# EAGLE design Schematic (EAGLE 6.4)
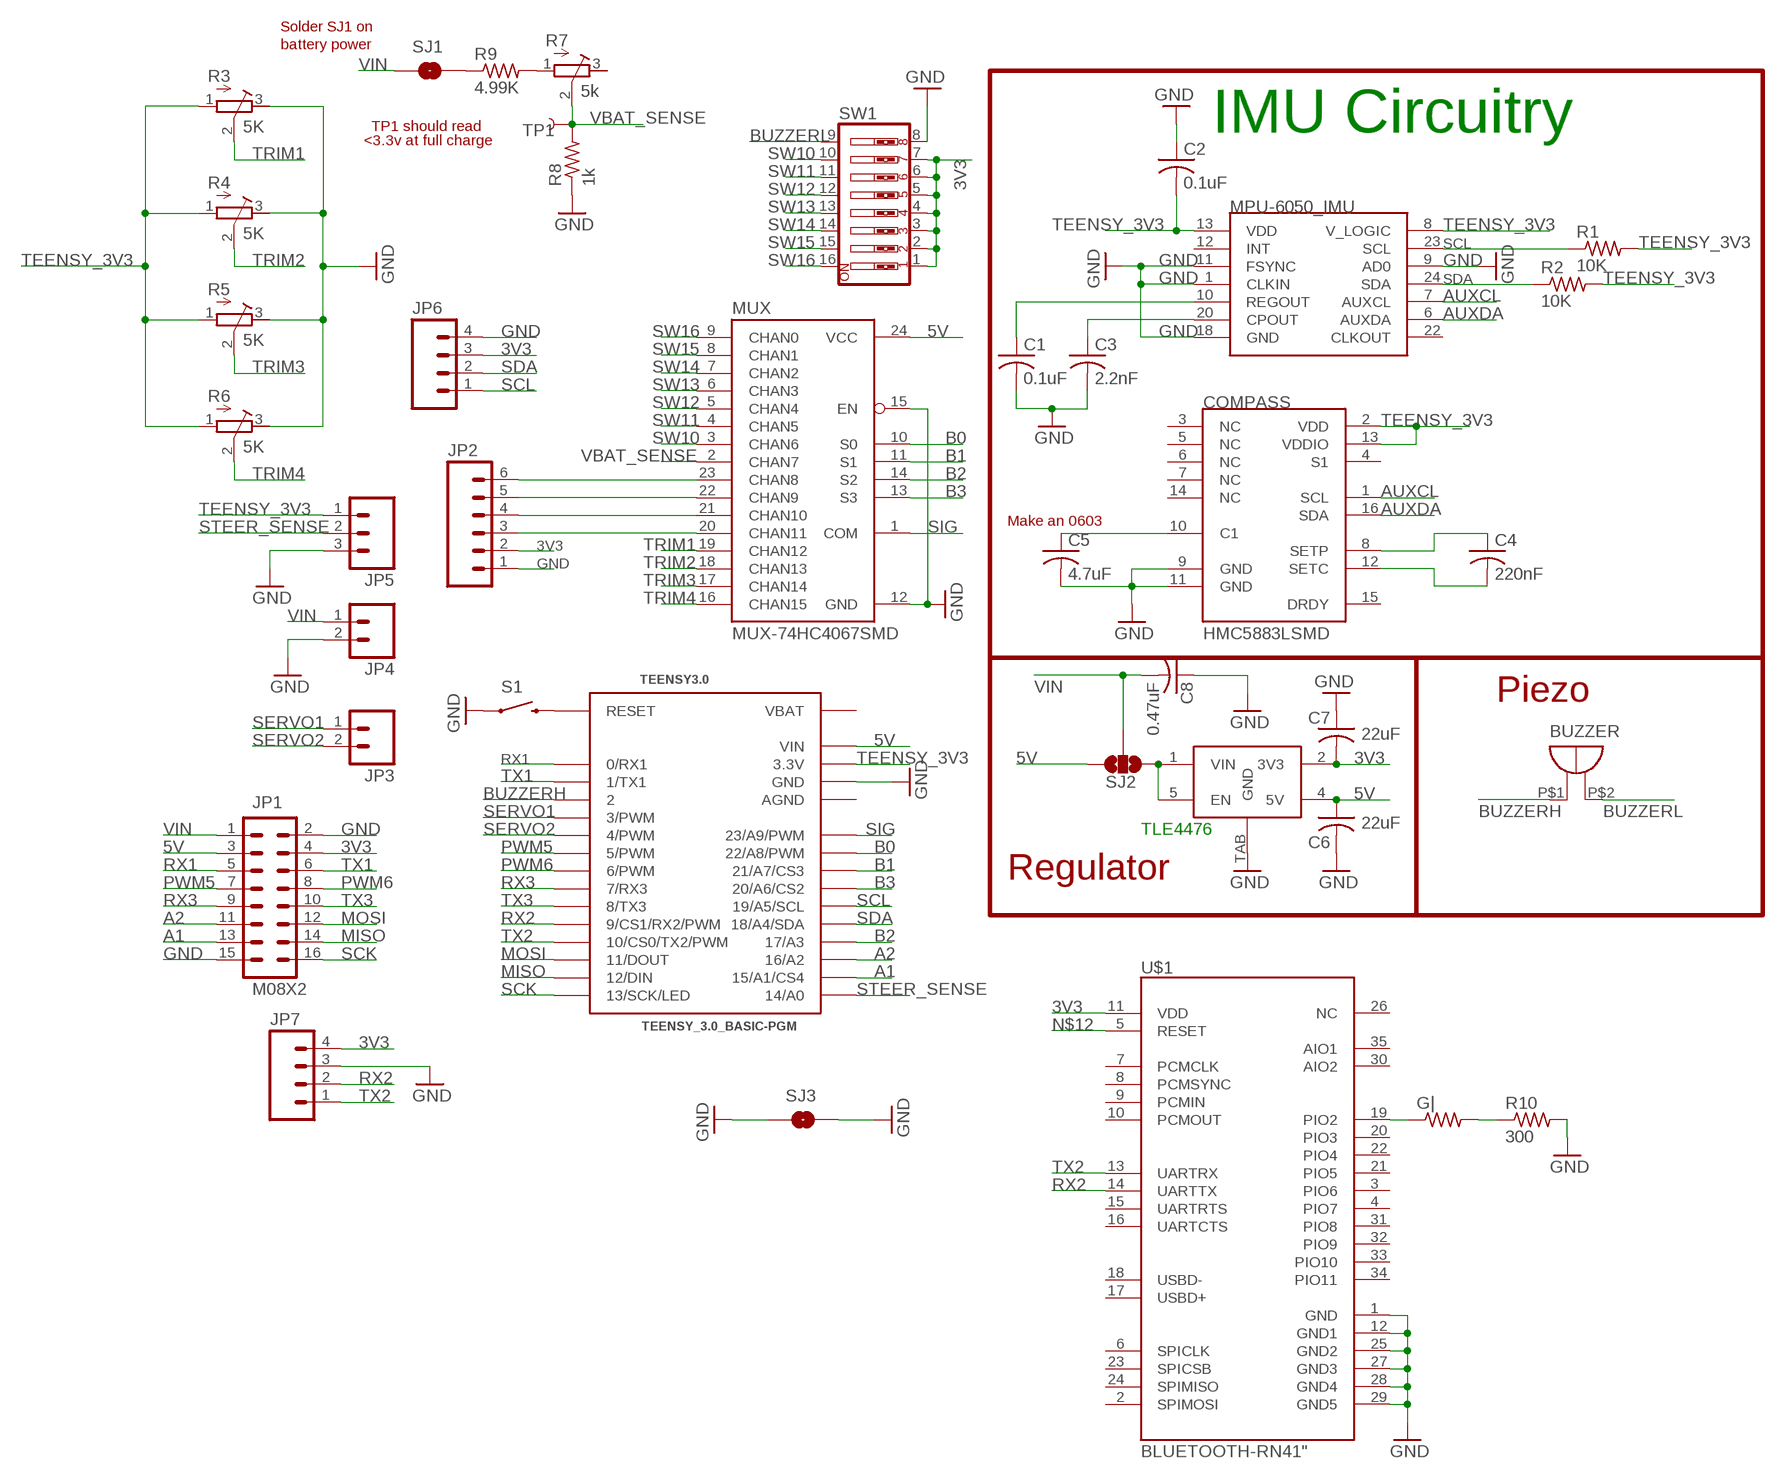
[diagram p0: schematic, sheet 1]

## Parts
BUZZER  PK-12N40PQ  [PK-12N40PQ]
C1  0.1uF  C-USC0603  [C0603]
C2  0.1uF  C-USC0603K  [C0603K]
C3  2.2nF  C-USC0603  [C0603]
C4  220nF  C-USC0402  [C0402]
C5  4.7uF  C-USC0402  [C0402]
C6  22uF  C-USC0805  [C0805]
C7  22uF  C-USC0805  [C0805]
C8  0.47uF  C-USC0805  [C0805]
COMPASS  HMC5883LSMD  [16LPCC]
G|  R-US_R0805  [R0805]
IC1  TLE4467  [TO252-5-11]
JP1  M08X2  [2X8]
JP2  M06SIP  [1X06]
JP3  M023.5MM  [SCREWTERMINAL-3.5MM-2]
JP4  M023.5MM  [SCREWTERMINAL-3.5MM-2]
JP5  M03SCREW  [SCREWTERMINAL-3.5MM-3]
JP6  M04PTH  [1X04]
JP7  M04PTH  [1X04]
MPU-6050_IMU  MPU-6050  [QFN-24]
MUX  MUX-74HC4067SMD  [SSOP24]
R1  10K  R-US_R0603  [R0603]
R2  10K  R-US_R0603  [R0603]
R3  5K  R-TRIMM3304W  [RTRIM3304W]
R4  5K  R-TRIMM3304W  [RTRIM3304W]
R5  5K  R-TRIMM3304W  [RTRIM3304W]
R6  5K  R-TRIMM3304W  [RTRIM3304W]
R7  5k  R-TRIMM3304W  [RTRIM3304W]
R8  1k  R-US_R0603  [R0603]
R9  4.99K  R-US_R0603  [R0603]
R10  300  R-US_R0603  [R0603]
S1  SWITCH-MOMENTARY-2SMD  [TACTILE_SWITCH_SMD]
SJ1  SOLDERJUMPERNO  [SJ_2S-NO]
SJ2  SOLDERJUMPER_2WAYS  [SJ_3]
SJ3  SOLDERJUMPERNO  [SJ_2S-NO]
SW1  SW_DIP-8  [DIPSWITCH-08]
TEENSY3.0  TEENSY_3.0_BASIC-PGM  [TEENSY_3.0_BASIC-PGM]
TP1  TEST-POINT3  [PAD.03X.03]
U$1  BLUETOOTH-RN41"  [RN41]

## Nets
3V3 [3.3V]: C7.2 IC1.2(3V3) JP1.4 JP2.2 JP6.3 JP7.4 SW1.1 SW1.2 SW1.3 SW1.4 SW1.5 SW1.6 SW1.7 U$1.11(VDD)
5V [5V]: C6.1 IC1.4(5V) JP1.3 MUX.24(VCC) SJ2.3 TEENSY3.0.VIN
A1: JP1.13 TEENSY3.0.15/A1(15/A1/CS4)
A2: JP1.11 TEENSY3.0.16/A2
AUXCL [I/O]: COMPASS.1(SCL) MPU-6050_IMU.7(AUXCL)
AUXDA [I/O]: COMPASS.16(SDA) MPU-6050_IMU.6(AUXDA)
B0 [I/O]: MUX.10(S0) TEENSY3.0.22/A8(22/A8/PWM)
B1 [I/O]: MUX.11(S1) TEENSY3.0.21/A7(21/A7/CS3)
B2 [I/O]: MUX.14(S2) TEENSY3.0.17/A3
B3 [I/O]: MUX.13(S3) TEENSY3.0.20/A6(20/A6/CS2)
BUZZERH [I/O]: BUZZER.P$1(+) TEENSY3.0.2
BUZZERL: BUZZER.P$2(-) SW1.9
GND: C1.2 C2.1 C3.2 C5.2 C6.2 C7.1 C8.1 COMPASS.9(GND) COMPASS.11(GND) IC1.TAB(GND) JP1.2 JP1.15 JP2.1 JP4.2 JP5.3 JP6.4 JP7.3 MPU-6050_IMU.1(CLKIN) MPU-6050_IMU.9(AD0) MPU-6050_IMU.11(FSYNC) MPU-6050_IMU.18(GND) MUX.12(GND) MUX.15(EN) R3.3(A) R4.3(A) R5.3(A) R6.3(A) R8.1 R10.2 S1.1 SJ3.1 SJ3.2 SW1.8 TEENSY3.0.GND TEENSY3.0.GND1(GND) U$1.1(GND) U$1.12(GND1) U$1.25(GND2) U$1.27(GND3) U$1.28(GND4) U$1.29(GND5)
MISO: JP1.14 TEENSY3.0.12(12/DIN)
MOSI: JP1.12 TEENSY3.0.11(11/DOUT)
N$1: C1.1 MPU-6050_IMU.10(REGOUT)
N$2: C3.1 MPU-6050_IMU.20(CPOUT)
N$3: R7.1(E) R9.2
N$4: R9.1 SJ1.2
N$5: JP2.6 MUX.23(CHAN8)
N$6: JP2.5 MUX.22(CHAN9)
N$7 [I/O]: C4.1 COMPASS.8(SETP)
N$8 [I/O]: C4.2 COMPASS.12(SETC)
N$9 [I/O]: C5.1 COMPASS.10(C1)
N$10: JP2.4 MUX.21(CHAN10)
N$11: JP2.3 MUX.20(CHAN11)
N$12: S1.3 TEENSY3.0.RESET U$1.5(RESET)
N$13: G|.1 U$1.19(PIO2)
N$14: G|.2 R10.1
PWM5: JP1.7 TEENSY3.0.5(5/PWM)
PWM6: JP1.8 TEENSY3.0.6(6/PWM)
REG_IN [Vss]: IC1.1(VIN) IC1.5(EN) SJ2.1
RX1: JP1.5 TEENSY3.0.0(0/RX1)
RX2: JP7.2 TEENSY3.0.9(9/CS1/RX2/PWM) U$1.14(UARTTX)
RX3: JP1.9 TEENSY3.0.7(7/RX3)
SCK: JP1.16 TEENSY3.0.13(13/SCK/LED)
SCL [I/O]: JP6.1 MPU-6050_IMU.23(SCL) R1.1 TEENSY3.0.19/A5(19/A5/SCL)
SDA [I/O]: JP6.2 MPU-6050_IMU.24(SDA) R2.1 TEENSY3.0.18/A4(18/A4/SDA)
SERVO1 [I/O]: JP3.1 TEENSY3.0.3(3/PWM)
SERVO2 [I/O]: JP3.2 TEENSY3.0.4(4/PWM)
SIG [I/O]: MUX.1(COM) TEENSY3.0.23/A9(23/A9/PWM)
STEER_SENSE: JP5.2 TEENSY3.0.14/A0
SW10: MUX.3(CHAN6) SW1.10
SW11: MUX.4(CHAN5) SW1.11
SW12: MUX.5(CHAN4) SW1.12
SW13: MUX.6(CHAN3) SW1.13
SW14: MUX.7(CHAN2) SW1.14
SW15: MUX.8(CHAN1) SW1.15
SW16: MUX.9(CHAN0) SW1.16
TEENSY_3V3 [3.3V]: C2.2 COMPASS.2(VDD) COMPASS.13(VDDIO) JP5.1 MPU-6050_IMU.8(V_LOGIC) MPU-6050_IMU.13(VDD) R1.2 R2.2 R3.1(E) R4.1(E) R5.1(E) R6.1(E) TEENSY3.0.3.3V TEENSY3.0.3.3V1(3.3V)
TRIM1: MUX.19(CHAN12) R3.2(S)
TRIM2: MUX.18(CHAN13) R4.2(S)
TRIM3: MUX.17(CHAN14) R5.2(S)
TRIM4: MUX.16(CHAN15) R6.2(S)
TX1: JP1.6 TEENSY3.0.1(1/TX1)
TX2: JP7.1 TEENSY3.0.10(10/CS0/TX2/PWM) U$1.13(UARTRX)
TX3: JP1.10 TEENSY3.0.8(8/TX3)
VBAT_SENSE: MUX.2(CHAN7) R7.2(S) R8.2 TP1.P$1
VIN [Vss]: C8.2 JP1.1 JP4.1 SJ1.1 SJ2.2
Unconnected: COMPASS.3(NC) COMPASS.4(S1) COMPASS.5(NC) COMPASS.6(NC) COMPASS.7(NC) COMPASS.14(NC) COMPASS.15(DRDY) MPU-6050_IMU.12(INT) MPU-6050_IMU.22(CLKOUT) R7.3(A) U$1.2(SPIMOSI) U$1.3(PIO6) U$1.4(PIO7) U$1.6(SPICLK) U$1.7(PCMCLK) U$1.8(PCMSYNC) U$1.9(PCMIN) U$1.10(PCMOUT) U$1.15(UARTRTS) U$1.16(UARTCTS) U$1.17(USBD+) U$1.18(USBD-) U$1.20(PIO3) U$1.21(PIO5) U$1.22(PIO4) U$1.23(SPICSB) U$1.24(SPIMISO) U$1.26(NC) U$1.30(AIO2) U$1.31(PIO8) U$1.32(PIO9) U$1.33(PIO10) U$1.34(PIO11) U$1.35(AIO1)

## Notes on the sheet
- Solder SJ1 on
- battery power
- TP1 should read | IMU Circuitry
- <3.3v at full charge
- Make an 0603
- Piezo
- TLE4476
- Regulator

## Power pins joined to a net without a drawn wire
AGND: TEENSY3.0.AGND
VIN: TEENSY3.0.VBAT

## Library data of the parts
BUZZER = buzzer:PK-12N40PQ
C1 = resistor:C-US: CAPACITOR, American symbol; RATED_VOLTAGE: 2
C2 C4-C8 = resistor:C-US: CAPACITOR, American symbol
C3 = resistor:C-US: CAPACITOR, American symbol; RATED_VOLTAGE: 50
COMPASS = SparkFun-Sensors:HMC5883L: 3 Axis Digital Compass IC
G| R1 R2 R8-R10 = resistor:R-US_: RESISTOR, American symbol
IC1 = infineon:TLE4467: Digikey Part number: TLE4476DCT-ND
JP1 = SparkFun-Connectors:M08X2: .1" headers, two rows of 8 each
JP2 = SparkFun-Connectors:M06: Header 6 Standard 6-pin 0.1" header. Use with straight break away headers (SKU : PRT-00116), right angle break away headers (PRT-00553), swiss pins (PRT-00743), machine pins (PRT-00117), and female headers (PRT-00115). Molex polarized connector foot print use with SKU : PRT-08094 with associated crimp pins and housings. NOTES ON THE VARIANTS LOCK and LOCK_LONGPADS... This footprint was designed to help hold the alignment of a through-hole component (i.e. 6-pin header) while soldering it into place. You may notice that each hole has been shifted either up or down by 0.005 of an inch from it's more standard position (which is a perfectly straight line). This slight alteration caused the pins (the squares in the middle) to touch the edges of the holes. Because they are alternating, it causes a "brace" to hold the component in place. 0.005 has proven to be the perfect amount of "off-center" position when using our standard breakaway headers. Although looks a little odd when you look at the bare footprint, once you have a header in there, the alteration is very hard to notice. Also, if you push a header all the way into place, it is covered up entirely on the bottom side. This idea of altering the position of holes to aid alignment will be further integrated into the Sparkfun Library for other footprints. It can help hold any component with 3 or more connection pins.
JP3 JP4 = SparkFun-Connectors:M02: Header 2 Standard 2-pin 0.1" header. Use with straight break away headers (SKU : PRT-00116), right angle break away headers (PRT-00553), swiss pins (PRT-00743), machine pins (PRT-00117), and female headers (PRT-00115). Molex polarized connector foot print use with SKU : PRT-08233 with associated crimp pins and housings.
JP5 = SparkFun-Connectors:M03: Header 3 Standard 3-pin 0.1" header. Use with straight break away headers (SKU : PRT-00116), right angle break away headers (PRT-00553), swiss pins (PRT-00743), machine pins (PRT-00117), and female headers (PRT-00115). Molex polarized connector foot print use with SKU : PRT-08232 with associated crimp pins and housings.
JP6 JP7 = SparkFun-Connectors:M04: Header 4 Standard 4-pin 0.1" header. Use with straight break away headers (SKU : PRT-00116), right angle break away headers (PRT-00553), swiss pins (PRT-00743), machine pins (PRT-00117), and female headers (PRT-00115). Molex polarized connector foot print use with SKU : PRT-08231 with associated crimp pins and housings. 1MM SMD Version SKU: PRT-10208
MPU-6050_IMU = SparkFun-Sensors:MPU-6050: MPU-6000 - I2C address is 0x68 with AD0 low and 0x69 with AD0 high.
MUX = SparkFun-AnalogIC:MUX-74HC4067: 16-channel analog MUX
R3-R7 = resistor:R-TRIMM: Trimm resistor
S1 = SparkFun-Electromechanical:SWITCH-MOMENTARY-2: Various NO switches- pushbuttons, reed, etc
SJ1 SJ3 = SparkFun-Passives:SOLDERJUMPER: Solder Jumper Standard SMD solder jumper. Used to automate production. Two varients : Normally Open and Normally Closed are the same, but have different paste layers. NC will have a large amount of paste and should jumper during reflow.
SJ2 = SparkFun-Passives:SOLDERJUMPER_2WAY: Solder Jumper 2 way solder jumper
SW1 = SparkFun-Electromechanical:SW_DIP-8: DIP Switch 8 Position Spark Fun Electronics SKU : COM-08034
TEENSY3.0 = Teensy3.0:TEENSY_3.0_BASIC-PGM: Teensy 3.0 Board outline identical to other 'basic' version except that 'PGM' pin has been omitted. See '+4', 'AllAnalogPins", and 'AllPins' packages for additional pin holes, as needed.
TP1 = SparkFun-Passives:TEST-POINT: Bare copper test points for troubleshooting or ICT
U$1 = SparkFun-RF:BLUETOOTH-RN41: Bluetooth SMD module

## Board
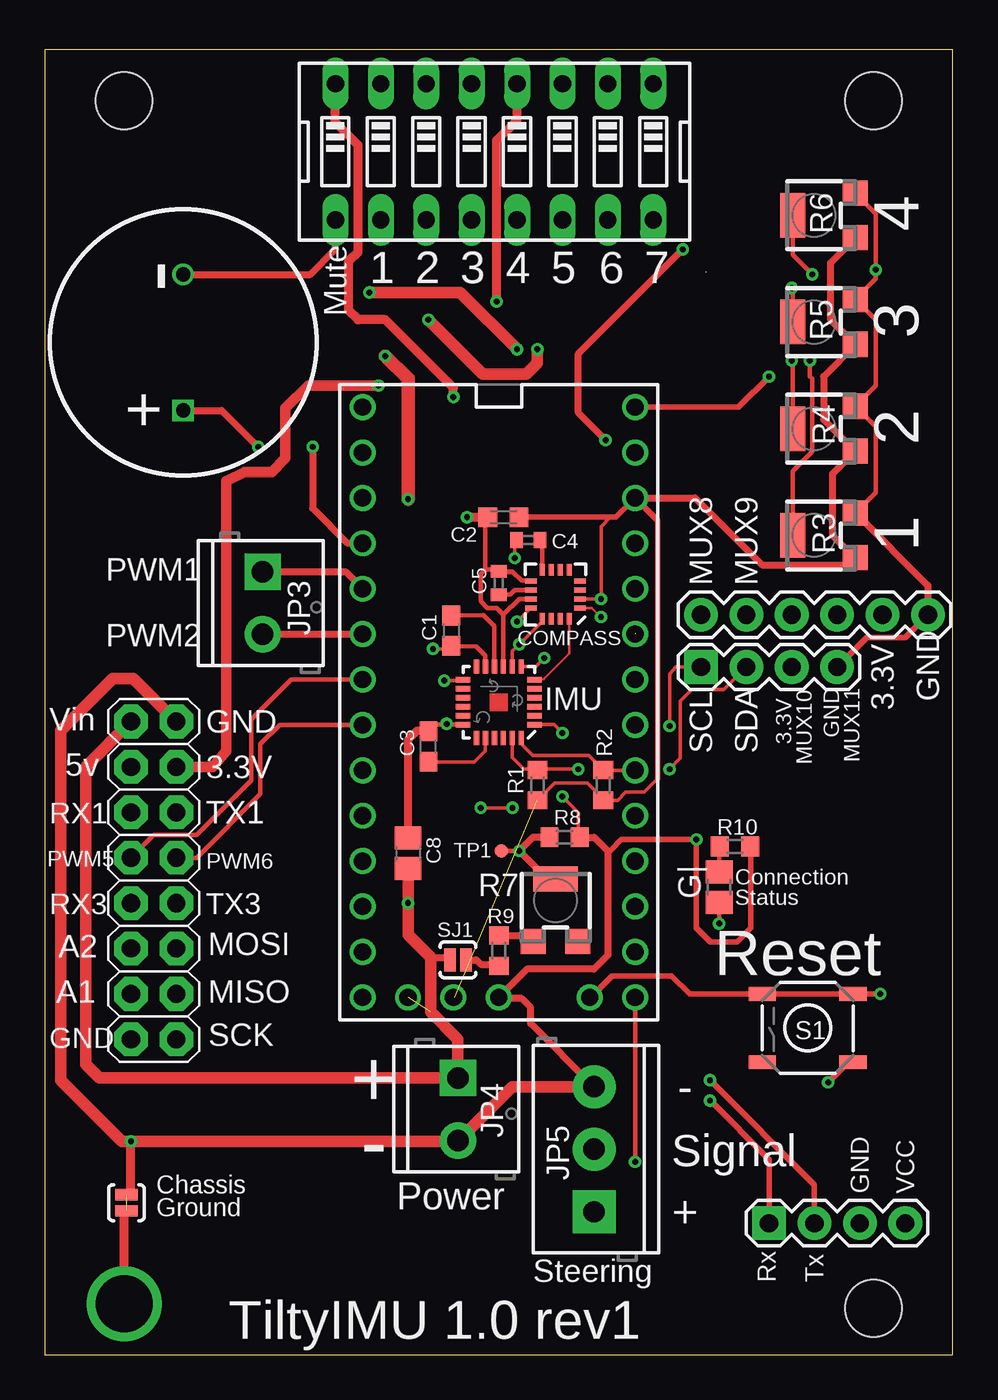
[diagram p1: board, top side]
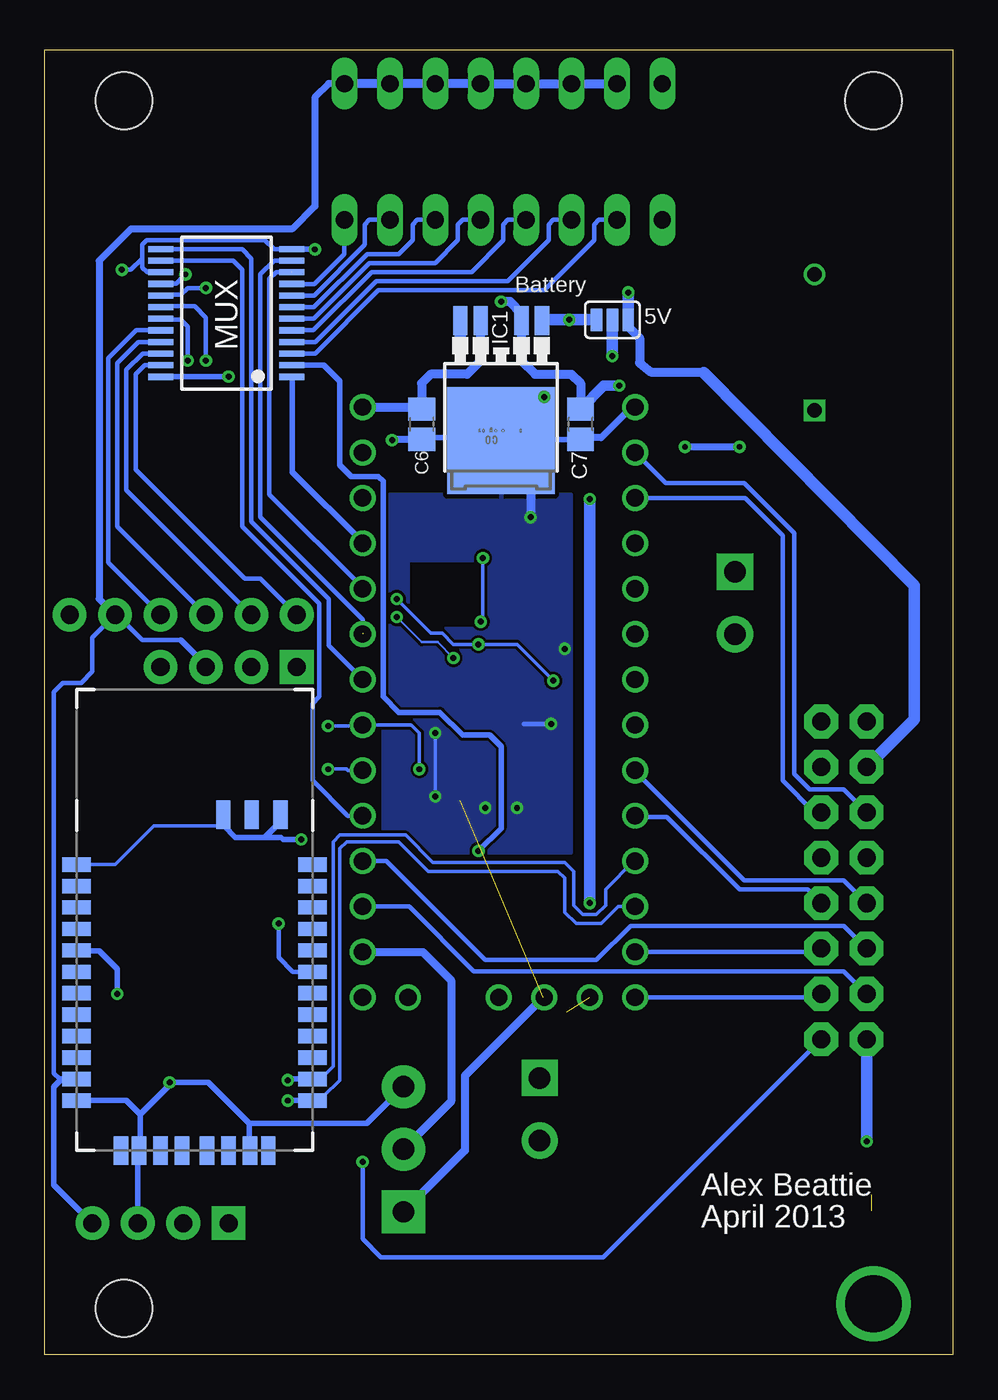
[diagram p2: board, bottom side, seen from below]

Size 50.8 x 73.03 mm. Coordinates in mm from the lower left corner, seen from the top.
Outline: 0,0 50.8,0 50.8,73.03 0,73.03 0,0
Copper layers (1*16): Top 0.0356mm / dielectric 1.5011mm / Bottom 0.0356mm
Design rules "default": minimum track width 6mil, minimum drill 13mil, track to track 6mil, track to pad 6mil, pad to pad 6mil, via to via 6mil, smd to smd 6mil, copper to edge 15mil, drill to drill 6mil, minimum pad ring 7mil, minimum via ring 7mil, stop-mask expansion 4mil, vias tented up to drill 0mil, thermal gap 10mil
Holes 3.17 mm at 46.35,2.6 4.45,70.17 46.35,70.17

### Footprints (pad centres in the part's own frame; a part is rotated, then mirrored left to right if it is on the bottom)
PK-12N40PQ = drill 0.8 square: P$1 -3.8,0 | drill 0.8: P$2 3.8,0
C0603 = smd 1.1 x 1: 1 -0.85,0; 2 0.85,0
C0603K = smd 1.05 x 1.08: 1 -0.875,0; 2 0.875,0
C0402 = smd 0.7 x 0.9: 1 -0.65,0; 2 0.65,0
C0805 = smd 1.3 x 1.5: 1 -0.85,0; 2 0.85,0
16LPCC = smd 0.65 x 0.28: 1 -1.37,0.75; 2 -1.37,0.25; 3 -1.37,-0.25; 4 -1.37,-0.75; 9 1.37,-0.75; 10 1.37,-0.25; 11 1.37,0.25; 12 1.37,0.75 | smd 0.28 x 0.65: 5 -0.75,-1.37; 6 -0.25,-1.37; 7 0.25,-1.37; 8 0.75,-1.37; 13 0.75,1.37; 14 0.25,1.37; 15 -0.25,1.37; 16 -0.75,1.37
R0805 = smd 1.3 x 1.5: 1 -0.85,0; 2 0.85,0
TO252-5-11 = smd 0.8 x 1.6: 1 -2.28,-5.41; 2 -1.14,-5.41; 4 1.14,-5.41; 5 2.28,-5.41 | smd 6 x 6: TAB 0,1.3
2X8 = drill 1.016 pad 1.88 octagon: 1 0,0; 2 0,2.54; 3 2.54,0; 4 2.54,2.54; 5 5.08,0; 6 5.08,2.54; 7 7.62,0; 8 7.62,2.54; 9 10.16,0; 10 10.16,2.54; 11 12.7,0; 12 12.7,2.54; 13 15.24,0; 14 15.24,2.54; 15 17.78,0; 16 17.78,2.54
1X06 = drill 1.016 pad 1.88: 1 0,0; 2 2.54,0; 3 5.08,0; 4 7.62,0; 5 10.16,0; 6 12.7,0
SCREWTERMINAL-3.5MM-2 = drill 1.2 pad 2.032 square: 1 0,0 | drill 1.2 pad 2.032: 2 3.5,0
SCREWTERMINAL-3.5MM-3 = drill 1.2 pad 2.413 square: 1 0,0 | drill 1.2 pad 2.413: 2 3.5,0; 3 7,0
1X04 = drill 1.016 pad 1.88 square: 1 0,0 | drill 1.016 pad 1.88: 2 2.54,0; 3 5.08,0; 4 7.62,0
QFN-24 = smd 0.8 x 0.3: 1 -2,1.25; 2 -2,0.75; 3 -2,0.25; 4 -2,-0.25; 5 -2,-0.75; 6 -2,-1.25; 13 2,-1.25; 14 2,-0.75; 15 2,-0.25; 16 2,0.25; 17 2,0.75; 18 2,1.25 | smd 0.3 x 0.8: 7 -1.25,-2; 8 -0.75,-2; 9 -0.25,-2; 10 0.25,-2; 11 0.75,-2; 12 1.25,-2; 19 1.25,2; 20 0.75,2; 21 0.25,2; 22 -0.25,2; 23 -0.75,2; 24 -1.25,2
SSOP24 = smd 0.348 x 1.397: 1 -3.575,-3.656; 2 -2.925,-3.656; 3 -2.275,-3.656; 4 -1.625,-3.656; 5 -0.975,-3.656; 6 -0.325,-3.656; 7 0.325,-3.656; 8 0.975,-3.656; 9 1.625,-3.656; 10 2.275,-3.656; 11 2.925,-3.656; 12 3.575,-3.656; 13 3.575,3.656; 14 2.925,3.656; 15 2.275,3.656; 16 1.625,3.656; 17 0.975,3.656; 18 0.325,3.656; 19 -0.325,3.656; 20 -0.975,3.656; 21 -1.625,3.656; 22 -2.275,3.656; 23 -2.925,3.656; 24 -3.575,3.656
R0603 = smd 1 x 1.1: 1 -0.85,0; 2 0.85,0
RTRIM3304W = smd 1.4 x 1.4: 1 -1.25,-1.9; 3 1.25,-1.9 | smd 2.5 x 1.4: 2 0,1.6
TACTILE_SWITCH_SMD = smd 1.524 x 0.762: 1 -2.54,1.905; 2 2.54,1.905; 3 -2.54,-1.905; 4 2.54,-1.905
SJ_2S-NO = smd 0.635 x 1.27: 1 -0.45,0; 2 0.45,0
SJ_3 = smd 0.635 x 1.27: 1 -0.889,0; 2 0,0; 3 0.889,0
DIPSWITCH-08 = drill 0.97 long: 1 -8.89,-3.81; 2 -6.35,-3.81; 3 -3.81,-3.81; 4 -1.27,-3.81; 5 1.27,-3.81; 6 3.81,-3.81; 7 6.35,-3.81; 8 8.89,-3.81; 9 8.89,3.81; 10 6.35,3.81; 11 3.81,3.81; 12 1.27,3.81; 13 -1.27,3.81; 14 -3.81,3.81; 15 -6.35,3.81; 16 -8.89,3.81
TEENSY_3.0_BASIC-PGM = drill 0.965: 0 -7.62,13.97; 1 -7.62,11.43; 2 -7.62,8.89; 3 -7.62,6.35; 3.3V 7.62,11.43; 3.3V1 -2.54,-16.51; 4 -7.62,3.81; 5 -7.62,1.27; 6 -7.62,-1.27; 7 -7.62,-3.81; 8 -7.62,-6.35; 9 -7.62,-8.89; 10 -7.62,-11.43; 11 -7.62,-13.97; 12 -7.62,-16.51; 13 7.62,-16.51; 14/A0 7.62,-13.97; 15/A1 7.62,-11.43; 16/A2 7.62,-8.89; 17/A3 7.62,-6.35; 18/A4 7.62,-3.81; 19/A5 7.62,-1.27; 20/A6 7.62,1.27; 21/A7 7.62,3.81; 22/A8 7.62,6.35; 23/A9 7.62,8.89; AGND 7.62,13.97; GND -7.62,16.51; GND1 0,-16.51; RESET 5.08,-16.51; VBAT -5.08,-16.51; VIN 7.62,16.51
PAD.03X.03 = smd 0.762 x 0.762: P$1 0,0
RN41 = smd 0.8 x 1.6: 1 -6.6,-6.6; 2 -5.4,-6.6; 3 -4.2,-6.6; 4 -3,-6.6; 5 -1.8,-6.6; 6 -0.6,-6.6; 7 0.6,-6.6; 8 1.8,-6.6; 9 3,-6.6; 10 4.2,-6.6; 11 5.4,-6.6; 12 6.6,-6.6; 13 6.6,6.6; 14 5.4,6.6; 15 4.2,6.6; 16 3,6.6; 17 1.8,6.6; 18 0.6,6.6; 19 -0.6,6.6; 20 -1.8,6.6; 21 -3,6.6; 22 -4.2,6.6; 23 -5.4,6.6; 24 -6.6,6.6 | smd 1.6 x 0.8: 25 -9.4,4.8; 26 -9.4,3.2; 27 -9.4,1.6; 28 9.4,3.1; 29 9.4,-3.1; 30 9.4,-4.122; 31 9.4,-1.9; 32 9.4,-0.7; 33 9.4,0.7; 34 9.4,1.9; 35 9.4,4.122

### Placement (x,y rotation side)
BUZZER  7.75,56.64 90 top
C1  22.73,40.51 270 top
C2  25.65,46.86 0 top
C3  21.46,34.04 90 top
C4  27.05,45.59 180 top
C5  25.4,43.18 90 top
C6  29.72,52.07 270 bottom
C7  20.83,52.07 90 bottom
C8  20.32,28.07 270 top
COMPASS  28.57,42.55 180 top
G|  37.72,26.16 90 top
IC1  25.27,52.45 180 bottom
JP1  4.83,35.43 270 top
JP2  49.4,41.4 180 top
JP3  12.19,43.81 270 top
JP4  23.11,15.49 270 top
JP5  30.73,8 90 top
JP6  36.7,38.48 0 top
JP7  40.51,7.37 0 top
MPU-6050_IMU  25.4,36.51 180 top
MUX  40.64,58.29 90 bottom
R1  27.56,31.88 270 top
R2  31.24,31.88 270 top
R3  43.43,45.85 90 top
R4  43.43,51.82 90 top
R5  43.43,57.78 90 top
R6  43.43,63.75 90 top
R7  28.57,25.02 0 top
R8  29.08,28.96 180 top
R9  25.4,22.61 90 top
R10  38.61,28.45 0 top
S1  42.67,18.29 180 top
SJ1  23.11,22.1 0 top
SJ2  19.05,57.91 0 bottom
SJ3  4.57,8.51 90 top
SW1  25.15,67.31 180 top
TEENSY3.0  25.4,36.51 0 top
TP1  25.53,28.19 270 top
U$1  42.42,20.83 270 bottom

### Tracks (layer width: path | path; a pad name or v marks a point on that pad's centre or on a via)
3V3  (via drill 0.33)
  Top 0.508: v25.27,58.93 25.27,67.94 26.42,69.09 SW1.4
  Top 0.584: JP1.4 9.4,32.89 10.16,33.78 10.16,48.9 11.18,49.4 12.7,49.4 13.46,50.16 13.46,52.96 14.73,54.23 v18.67,54.23
  Bottom 0.254: U$1.11 49.97,15.43 50.29,15.75 50.29,37.08 49.78,37.59 48.77,37.59 48.13,38.23 48.13,40.13 JP2.2 46.74,41.4 45.34,40.01 43.18,40.01 | IC1.2
  Bottom 0.305: JP6.3 41.78,38.61 43.18,40.01 | U$1.11 49.85,15.43 50.29,14.99 50.29,9.53 JP7.4
  Bottom 0.381: SW1.1 34.92,71.12 35.69,70.36 35.69,64.26 36.96,62.99 45.97,62.99 47.75,61.21 47.75,42.29 JP2.2
  Bottom 0.508: C7.2 20.83,54.36 21.34,54.86 23.37,54.86 24.13,55.63 IC1.2 24.13,58.3 24.77,58.93 v25.27,58.93 | SW1.1 SW1.2 SW1.3 SW1.4 SW1.5 SW1.6 SW1.7
  Bottom 0.584: v18.67,54.23 19.52,54.23 C7.2
5V  (via drill 0.33)
  Top 0.305: TEENSY3.0.VIN 38.8,53.02 v40.51,54.74
  Top 0.635: v18.16,59.44 23.24,59.44 v26.42,56.26
  Bottom 0.305: v40.51,54.74 44.28,54.74 MUX.24
  Bottom 0.508: IC1.4 v26.42,56.26 v26.41,56.26 26.41,55.63 27.18,54.86 29.21,54.86 29.72,54.36 C6.1 29.82,53.02 TEENSY3.0.VIN | SJ2.3 18.16,57.53 17.53,56.9 17.53,55.5 16.89,54.99 13.97,54.99 13.93,54.95
  Bottom 0.635: SJ2.3 v18.16,59.44 | 13.93,54.95 2.16,43.05 2.16,35.56 JP1.3
A1
  Bottom 0.254: JP1.13 6.1,21.46 26.8,21.46 30.42,25.08 TEENSY3.0.15/A1
A2
  Bottom 0.254: JP1.11 6.1,24 18.03,24 19.94,22.1 26.16,22.1 31.69,27.62 TEENSY3.0.16/A2
AUXCL  (via drill 0.33)
  Top 0.152: COMPASS.1 30.59,41.8 v31.11,41.27
  Top 0.203: MPU-6050_IMU.7 27.46,38.51 v27.94,38.99
  Bottom 0.152: v27.94,38.99 28.83,39.88 29.72,39.88 v31.11,41.27
AUXDA
  Top 0.152: MPU-6050_IMU.6 27.9,37.81 29.34,39.24 29.34,41.16 COMPASS.16
B0  (1 unrouted)
  Bottom 0.254: TEENSY3.0.22/A8 33.02,42.93 38.23,48.13 38.23,60.2 37.85,60.58 36.99,60.58
B1  (1 unrouted)
  Bottom 0.254: MUX.11 37.97,61.21 38.73,60.45 38.73,46.86 33.02,41.15 33.02,40.39
B2
  Bottom 0.254: MUX.14 40.26,61.21 39.75,60.71 39.75,46.35 35.43,42.04 35.43,36.83 35.81,36.45 35.81,32.13 33.85,30.16 TEENSY3.0.17/A3
B3
  Bottom 0.254: MUX.13 44.28,61.85 39.75,61.85 39.24,61.34 39.24,46.61 34.92,42.29 34.92,39.69 TEENSY3.0.20/A6
BUZZERH  (via drill 0.33)
  Top 0.381: BUZZER.P$1 9.9,52.84 v11.94,50.8 | v14.99,50.8 14.99,47.37 16.95,45.4 TEENSY3.0.2
  Bottom 0.381: v11.94,50.8 v14.99,50.8
BUZZERL
  Top 0.381: BUZZER.P$2 14.85,60.44 16.26,61.85 SW1.9
GND  (via drill 0.33, 3.17)  (1 unrouted)
  Top 0.203: MPU-6050_IMU.11 24.64,38.62 24.64,39.12 | 24.13,39.62 22.73,39.62 | 21.83,35.26 C3.2 | 23.36,35.31 MPU-6050_IMU.18 | 27.4,35.31 MPU-6050_IMU.1 28.49,35.26 v28.96,34.8 | 29.84,29.04 29.84,30.35 v28.96,31.24 | v21.72,39.5 22.57,39.5 C1.2 | v24.38,30.61 v26.16,30.61
  Top 0.254: MPU-6050_IMU.11 24.64,38.65 24.64,39.12 24.13,39.62 24.12,39.64 C1.2 | MPU-6050_IMU.9 25.66,41.41 | 25.66,41.41 26.54,42.29 COMPASS.11 | C5.2 26.2,43.78 | COMPASS.9 26.67,43.31 26.2,43.78 | 26.2,43.78 26.16,43.81 25.53,43.81 25.4,43.94 24.64,43.94 | 24.64,43.94 24.38,43.69 24.38,42.16 24.77,41.78 25.28,41.78 25.66,41.41 | 24.64,43.94 24.64,46.72 C2.1 | R6.3 46.48,63.86 v46.48,60.71 46.48,60.2 45.33,59.05 R5.3 45.36,59.03 46.48,57.91 46.48,54.21 R4.3 45.36,53.07 46.48,51.94 46.48,48.24 R3.3 | 29.84,29.04 R8.1 | MPU-6050_IMU.18 22.52,35.26 v22.48,35.31 22.43,35.26 21.83,35.26
  Top 0.305: 31.5,28.19 31.62,28.19 32.26,28.83 v36.45,28.83 36.45,23.88 37.21,23.11 38.73,23.11 39.5,23.88 39.5,28.41 R10.2 | JP6.4 45.97,40.13 48.13,40.13 JP2.1 | S1.1 44.96,16.38 v43.81,15.24
  Top 0.381: v31.37,51.18 29.84,52.7 29.84,56.01 v35.69,61.85 | R8.1 30.73,28.96 31.5,28.19 31.5,22.35 30.73,21.59 26.99,21.59 TEENSY3.0.GND1 25.46,19.94 26.67,19.94 27.18,19.43 27.18,18.54 JP5.3 | R3.3 45.36,47.1 49.4,43.05 JP2.1
  Top 0.457: C8.1 20.32,34.42 20.83,34.92 21.42,34.92 C3.2
  Top 0.508: v23.62,46.86 C2.1 | v22.86,53.59 22.86,54.1 19.05,57.91 17.53,57.91 17.02,58.42 17.02,61.21 17.53,61.72 17.53,67.69 16.26,68.96 SW1.8 | SJ3.2 4.77,8.96 4.83,9.02 v4.83,11.94 | v4.45,2.86 4.45,7.93 SJ3.1
  Top 0.635: JP1.2 4.95,37.85 3.81,37.85 0.89,34.92 0.89,15.37 4.32,11.94 v4.83,11.94 23.06,11.94 JP4.2 23.17,11.99 26.16,14.99 30.72,14.99 JP5.3
  Bottom 0.203: 40.77,29.59 44.7,29.59 46.86,27.43 U$1.1 | v28.96,34.8 v28.96,31.24
  Bottom 0.254: MUX.15 45.07,60.57 45.34,60.83 45.34,61.34 | 45.34,61.34 45.34,62.1 45.09,62.36 38.48,62.36 37.97,61.85 37,61.85 MUX.12 | v46.48,60.71 45.97,60.71 45.34,61.34 | v22.48,35.31 24,35.31
  Bottom 0.305: C7.1 22.86,51.22 | 22.86,51.22 25.2,51.22 IC1.TAB 25.43,51.31 29.72,51.31 C6.2 | v35.69,61.85 36.97,61.85 MUX.12 | U$1.25 37.62,29.82 38.48,28.96 | U$1.27 40.77,30.18 40.77,29.59 40.13,28.96 38.48,28.96 | 45.47,13.46 43.81,15.11 v43.81,15.24 41.66,15.24 39.37,12.95 | 45.47,13.46 45.47,11.48 U$1.29 45.59,11.35 JP7.3 | 39.37,12.95 39.37,11.48 U$1.28 | U$1.12 46.23,14.23 45.47,13.46 | 38.48,28.96 37.59,28.96 37.47,28.83 v36.45,28.83 | v22.86,53.59 22.86,51.22 | 39.37,12.95 32.78,12.95 JP5.3
  Bottom 0.381: C6.2 31.33,51.22 v31.37,51.18 | TEENSY3.0.GND 17.97,53.02 19.68,51.31 20.74,51.31 C7.1
  Bottom 0.508: IC1.TAB 25.27,50.16 23.62,48.51 v23.62,46.86
  Bottom 0.635: JP1.15 v4.83,11.94
  pour Bottom: 21.34,28.07 21.34,48.13 31.88,48.13 31.88,44.45 26.67,44.45 26.67,40.64 30.48,40.64 30.48,44.32 31.88,44.32 31.88,28.07
MISO
  Bottom 0.254: TEENSY3.0.12 7.56,20 JP1.14
MOSI
  Bottom 0.254: TEENSY3.0.11 7.56,22.54 JP1.12
N$1
  Top 0.254: MPU-6050_IMU.10 25.15,38.66 25.15,40.77 24.52,41.39 C1.1
N$2
  Top 0.203: MPU-6050_IMU.20 24.64,34.41 24.64,33.78 24.02,33.16 21.49,33.16 C3.1
N$3
  Top 0.381: R9.2 26.99,23.46 R7.1
N$4
  Top 0.381: SJ1.2 24.13,22.1 24.38,21.84 25.31,21.84 R9.1
N$5
  Bottom 0.254: MUX.23 45.22,55.37 45.72,54.86 45.72,49.53 39.62,43.43 38.73,43.43 JP2.6
N$6
  Bottom 0.254: MUX.22 45.33,56.02 46.23,55.12 46.23,48.39 JP2.5
N$7
  Top 0.254: COMPASS.8 27.82,45.55 C4.1
N$8  (via drill 0.33)
  Top 0.203: COMPASS.12 v26.42,41.02 | v26.29,44.58 26.29,45.56 C4.2
  Bottom 0.203: v26.29,44.58 26.29,41.15 v26.42,41.02
N$9
  Top 0.254: COMPASS.10 26.29,42.8 26.04,42.55 25.43,42.55 C5.1
N$10
  Bottom 0.254: MUX.21 45.57,56.67 46.74,55.5 46.74,46.35 JP2.4
N$11
  Bottom 0.254: MUX.20 45.68,57.32 47.24,55.75 47.24,44.32 JP2.3
N$12  (via drill 0.33)
  Top 0.305: TEENSY3.0.RESET 30.54,20 31.75,21.21 35.05,21.21 36.07,20.19 S1.3 v46.74,20.19
  Bottom 0.305: v46.74,20.19 46.74,21.59 47.75,22.61 49,22.61 U$1.5
N$13  (via drill 0.33)
  Top 0.254: v37.72,24.13 G|.1
  Bottom 0.254: U$1.19 36.92,21.43 37.72,22.23 v37.72,24.13
N$14
  Top 0.254: G|.2 37.72,28.41 R10.1
PWM5
  Top 0.254: TEENSY3.0.5 13.78,37.78 11.56,35.56 11.56,32.13 8.51,29.08 6.1,29.08 JP1.7
PWM6
  Top 0.254: TEENSY3.0.6 13.14,35.24 12.06,34.16 12.06,31.37 8.51,27.81 JP1.8
REG_IN  (via drill 0.33)
  Top 0.635: v21.46,57.91 24.51,54.86 26.92,54.86 27.56,55.5 v27.56,56.26
  Bottom 0.635: v27.56,56.26 IC1.5 | SJ2.1 v21.46,57.91 22.94,57.91 IC1.1
RX1
  Bottom 0.254: JP1.5 6.1,31.62 8,31.62 8.89,32.51 8.89,45.97 11.68,48.77 16.07,48.77 TEENSY3.0.0
RX2  (via drill 0.33)
  Top 0.305: v37.21,15.37 43.05,9.53 JP7.2
  Bottom 0.203: TEENSY3.0.9 17.84,27.62 19.43,26.04 19.43,25.15 19.94,24.64 20.7,24.64 21.21,25.15 21.21,27.05 21.72,27.56 29.08,27.56 30.61,29.08 34.29,29.08 34.67,28.7 34.67,16.13 35.18,15.62 35.62,15.62 U$1.14
  Bottom 0.305: U$1.14 37.15,15.43 v37.21,15.37
RX3
  Bottom 0.254: TEENSY3.0.7 17.78,32.64 11.68,26.54 6.1,26.54 JP1.9
SCK  (via drill 0.33)
  Top 0.254: TEENSY3.0.13 v33.02,10.79
  Bottom 0.254: JP1.16 19.56,5.46 32,5.46 33.02,6.48 v33.02,10.79
SCL  (via drill 0.33)
  Top 0.203: v29.84,32.77 27.6,32.77 R1.1 27.52,32.77 26.8,32.77 26.15,33.41 MPU-6050_IMU.23 | v34.95,35.18 34.95,38.1 35.31,38.48 JP6.1
  Bottom 0.203: v29.84,32.77 29.84,34.8 30.29,35.24 TEENSY3.0.19/A5 33.47,35.24 33.53,35.18 v34.95,35.18
SDA  (via drill 0.33)
  Top 0.203: MPU-6050_IMU.24 26.65,34.18 27.3,33.53 30.44,33.53 R2.1 31.27,32.7 TEENSY3.0.18/A4 | v34.95,32.77 35.56,33.4 35.56,36.58 36.2,37.21 37.97,37.21 JP6.2
  Bottom 0.203: TEENSY3.0.18/A4 33.85,32.7 33.91,32.77 v34.95,32.77
SERVO1
  Top 0.381: JP3.1 16.83,43.81 TEENSY3.0.3
SERVO2
  Top 0.381: JP3.2 TEENSY3.0.4
SIG
  Bottom 0.305: TEENSY3.0.23/A9 33.02,45.47 36.96,49.4 36.96,54.69 MUX.1
STEER_SENSE
  Bottom 0.457: TEENSY3.0.14/A0 29.65,22.54 28.07,20.95 28.07,14.17 JP5.2
SW10
  Bottom 0.254: MUX.3 35.68,56.02 32.13,59.56 22.86,59.56 20.07,62.36 20.07,63.25 19.81,63.5 SW1.10
SW11
  Bottom 0.254: MUX.4 35.66,56.67 32.26,60.07 24.89,60.07 22.61,62.36 22.61,63.25 22.35,63.5 SW1.11
SW12
  Bottom 0.254: MUX.5 35.77,57.32 32.51,60.58 26.92,60.58 25.15,62.36 25.15,63.25 24.89,63.5 SW1.12
SW13
  Bottom 0.254: MUX.6 35.76,57.97 32.64,61.09 28.96,61.09 27.69,62.36 27.69,63.25 27.43,63.5 SW1.13
SW14
  Bottom 0.254: MUX.7 35.74,58.62 32.77,61.59 30.99,61.59 30.23,62.36 30.23,63.25 29.97,63.5 SW1.14
SW15
  Bottom 0.254: MUX.8 35.73,59.27 32.89,62.1 32.89,63.25 32.64,63.5 SW1.15
SW16
  Bottom 0.254: MUX.9 35.71,59.92 34.04,61.59 SW1.16
TEENSY_3V3  (via drill 0.33)  (1 unrouted)
  Top 0.203: MPU-6050_IMU.8 26.16,39.37 v26.54,39.75 27.82,41.03 COMPASS.13 | COMPASS.2 v31.11,42.29 31.11,46.35 31.62,46.86 | R1.2 28.54,32 30.35,32 31.24,31.11 R2.2 32.04,31.03 32.51,31.5 33.53,31.5 34.29,32.26 | v22.35,37.72 23.36,37.72 MPU-6050_IMU.13
  Top 0.305: C2.2 31.62,46.86 31.94,46.86 TEENSY3.0.3.3V 34.29,46.67 34.29,32.26
  Top 0.381: R6.1 45.33,62.48 43.94,61.09 43.94,57.93 R5.1 45.33,56.51 43.56,54.74 43.56,52.34 R4.1 44.07,49.3 44.07,45.85 R3.1 44.93,44.2 40.13,44.2 36.39,47.94 TEENSY3.0.3.3V
  Bottom 0.203: v31.11,42.29 29.21,40.39 28.57,40.39 27.94,39.75 v26.54,39.75 24.38,39.75 v22.35,37.72
  Bottom 0.457: TEENSY3.0.3.3V1 22.92,20 27.3,15.62 27.3,11.43 JP5.1
TRIM1  (via drill 0.33)
  Top 0.254: R3.2 41.83,49.45 42.93,50.55 42.93,54.61 42.8,54.74 v42.8,55.63
  Bottom 0.254: v42.8,55.63 42.8,57.53 43.18,57.91 44.24,57.91 MUX.19
TRIM2  (via drill 0.33)
  Top 0.254: R4.2 41.83,55.58 v41.78,55.63
  Bottom 0.254: v41.78,55.63 41.78,58.04 42.42,58.67 44.24,58.67 MUX.18
TRIM3  (via drill 0.33)
  Top 0.254: R5.2 41.83,59.64 v41.78,59.69
  Bottom 0.254: v41.78,59.69 42.8,59.69 43.18,59.31 44.26,59.31 MUX.17
TRIM4  (via drill 0.33)
  Top 0.254: R6.2 41.83,61.54 v42.93,60.45
  Bottom 0.254: v42.93,60.45 43.43,59.94 44.27,59.94 MUX.16
TX1
  Bottom 0.254: JP1.6 7.75,30.35 9.53,32.13 9.53,45.85 11.62,47.94 TEENSY3.0.1
TX2  (via drill 0.33)
  Top 0.305: v37.21,14.22 40.51,10.92 JP7.1
  Bottom 0.203: TEENSY3.0.10 18.73,25.08 19.68,24.13 21.08,24.13 21.72,24.77 21.72,26.67 22.1,27.05 29.34,27.05 30.99,28.7 33.91,28.7 34.29,28.32 34.29,15.37 35.18,14.48 35.57,14.48 U$1.13
  Bottom 0.305: U$1.13 v37.21,14.23 v37.21,14.22
TX3
  Bottom 0.254: JP1.10 8.13,26.04 11.94,26.04 16,30.1 17.72,30.1 TEENSY3.0.8
VBAT_SENSE  (via drill 0.33)
  Top 0.254: TP1.P$1 v26.54,28.19
  Top 0.381: 26.58,28.16 v26.54,28.19 | R7.2 28.12,26.62 v26.54,28.19 | R8.2 27.3,28.96 v26.54,28.19
  Bottom 0.305: MUX.2 35.18,55.37 34.29,54.48 34.29,49.78 33.66,49.15 32.13,49.15 31.88,48.9 31.88,36.83 30.99,35.94 28.7,35.94 27.43,34.67 25.91,34.67 25.27,34.04 25.27,29.46 v26.54,28.19
VIN  (via drill 0.33)  (1 unrouted)
  Top 0.381: 21.59,22.23 22.54,22.23 SJ1.1
  Top 0.635: JP1.1 2.29,32.89 2.29,16.26 3.05,15.49 JP4.1 23.11,17.65 21.59,19.18 21.59,22.23 20.32,23.5 v20.32,25.27 C8.2
  Top 0.762: v20.32,47.88 20.32,54.61 v19.05,55.88
  Bottom 0.635: v19.05,55.88 SJ2.2 | v20.32,47.88 v20.32,25.27

### Text on the board
tNames: 4 | Mute | 1 | 2 | 3 | 4 | 5 | 6 | 7 | R5 | 3 | 2 | 1 | PWM1 | MUX8 | MUX9 | PWM2 | GND | IMU | 3.3V | Vin | GND | GND | SCL | SDA | 3.3V | MUX10 | MUX11 | 5v | 3.3V | RX1 | TX1 | TP1 | PWM5 | PWM6 | Connection | RX3 | TX3 | Status | A2 | MOSI | Reset | A1 | MISO | GND | SCK | + | - | - | Signal | Chassis | GND | VCC | Ground | Power | + | Steering | Rx | Tx | TiltyIMU 1.0 rev1
bNames: Battery | 5V | Alex Beattie | April 2013